# EAGLE schematic nixie_arduino (EAGLE 6.1)
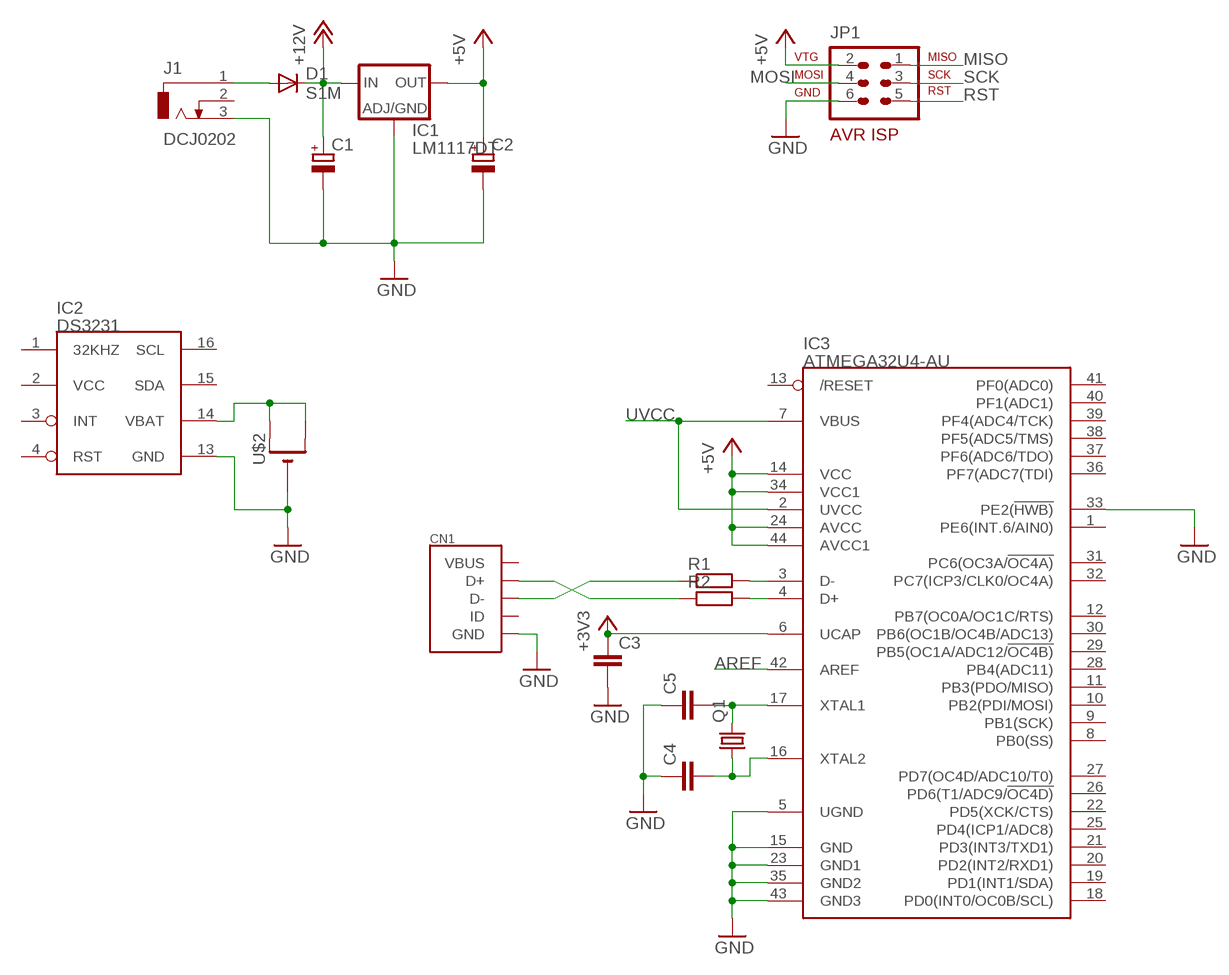
[diagram p0: schematic, sheet 1]

## Parts
C1  CPOL-EUD  [PANASONIC_D]
C2  CPOL-EUD  [PANASONIC_D]
C3  C-EUC0805K  [C0805K]
C4  C-EUC0805K  [C0805K]
C5  C-EUC0805K  [C0805K]
CN1  USBMINIB  [USB-MINIB]
D1  S1M  [DO-214AC]
IC1  LM1117DT  [DPACK]
IC2  DS3231  [SO16]
IC3  ATMEGA32U4-AU  [TQFP44]
J1  DCJ0202  [DCJ0202A]
JP1  AVR-ISP-6  [AVR-ISP-6]
Q1  CRYSTALHC49UP  [HC49UP]
R1  R-EU_R0805  [R0805]
R2  R-EU_R0805  [R0805]
U$2  CR1220SMT  [CR1220-SMD]

## Nets
+3V3: C3.1 IC3.6(UCAP)
+5V: C2.+ IC1.4(OUT) IC3.14(VCC) IC3.24(AVCC) IC3.34(VCC1) IC3.44(AVCC1) JP1.2(VTG)
+12V: C1.+ D1.C IC1.3(IN)
AREF: IC3.42(AREF)
GND: C1.- C2.- C3.2 C4.1 C5.1 CN1.GND IC1.1(ADJ) IC2.13(GND) IC3.5(UGND) IC3.15(GND) IC3.23(GND1) IC3.33(PE2(!HWB)) IC3.35(GND2) IC3.43(GND3) J1.3 JP1.6(GND) U$2.-
MISO: JP1.1(MISO)
MOSI: JP1.4(MOSI)
N$1: D1.A J1.1
N$2: IC2.14(VBAT) U$2.+$1(+) U$2.+$2(+1)
N$3: IC3.3(D-) R1.2
N$4: IC3.4(D+) R2.2
N$5: CN1.D+ R2.1
N$6: CN1.D- R1.1
N$8: C4.2 IC3.16(XTAL2) Q1.1
N$9: C5.2 IC3.17(XTAL1) Q1.2
RST: JP1.5(RST)
SCK: JP1.3(SCK)
UVCC: IC3.2(UVCC) IC3.7(VBUS)
Unconnected: CN1.ID IC2.1(32KHZ) IC2.2(VCC) IC2.3(INT) IC2.4(RST) IC2.15(SDA) IC2.16(SCL) IC3.1(PE6(INT.6/AIN0)) IC3.8(PB0(SS)) IC3.9(PB1(SCK)) IC3.10(PB2(PDI/MOSI)) IC3.11(PB3(PDO/MISO)) IC3.12(PB7(OC0A/OC1C/RTS)) IC3.13(/RESET) IC3.18(PD0(INT0/OC0B/SCL)) IC3.19(PD1(INT1/SDA)) IC3.20(PD2(INT2/RXD1)) IC3.21(PD3(INT3/TXD1)) IC3.22(PD5(XCK/CTS)) IC3.25(PD4(ICP1/ADC8)) IC3.26(PD6(T1/ADC9/!OC4D)) IC3.27(PD7(OC4D/ADC10/T0)) IC3.28(PB4(ADC11)) IC3.29(PB5(OC1A/ADC12/!OC4B)) IC3.30(PB6(OC1B/OC4B/ADC13)) IC3.31(PC6(OC3A/!OC4A)) IC3.32(PC7(ICP3/CLK0/OC4A)) IC3.36(PF7(ADC7(TDI)) IC3.37(PF6(ADC6/TDO)) IC3.38(PF5(ADC5/TMS)) IC3.39(PF4(ADC4/TCK)) IC3.40(PF1(ADC1)) IC3.41(PF0(ADC0)) J1.2

## Power pins joined to a net without a drawn wire
VBUS: CN1.VBUS

## Library data of the parts
C1 C2 = nixie_tube:CPOL-EU: POLARIZED CAPACITOR, European symbol
C3-C5 = nixie_tube:C-EU: CAPACITOR, European symbol
CN1 = nixie_tube:USB: USB Connectors USBMINIB - Surface Mount Female Mini-B USB Connector 4UConnector: 06564 By microbuilder.eu Thru-hole RA Female Mini-B USB Connector 4UConnector: 18732 By ladyada.net
D1 = nixie_tube:S1M
IC1 = nixie_tube:LM1117: Low drop fixed and adjustable positive voltage regulators 1 A Source: http://www.st.com/stonline/products/literature/ds/7194/ld1117axx.pdf
IC2 = nixie_tube:DS3231
IC3 = nixie_tube:ATMEGA32U4: http://www.ladyada.net/library/eagle
J1 = nixie_tube:DCJ0202: DC POWER JACK Source: DCJ0202.pdf
JP1 = nixie_tube:AVR-ISP-6: AVR ISP-6 Serial Programming Header
Q1 = nixie_tube:CRYSTAL: CRYSTAL
R1 R2 = nixie_tube:R-EU_: RESISTOR, European symbol
U$2 = nixie_tube:CR1220: CR1216/CR1220/CR1225 12mm 3V lithium coin cell Great for battery packup. Both SMT and THM holders. Note the THM package has the ground pads on both sides of the PCB so that the masks are the same - this reduces the cost